# Altium schematic sheet 4-Power.SchDoc
size A
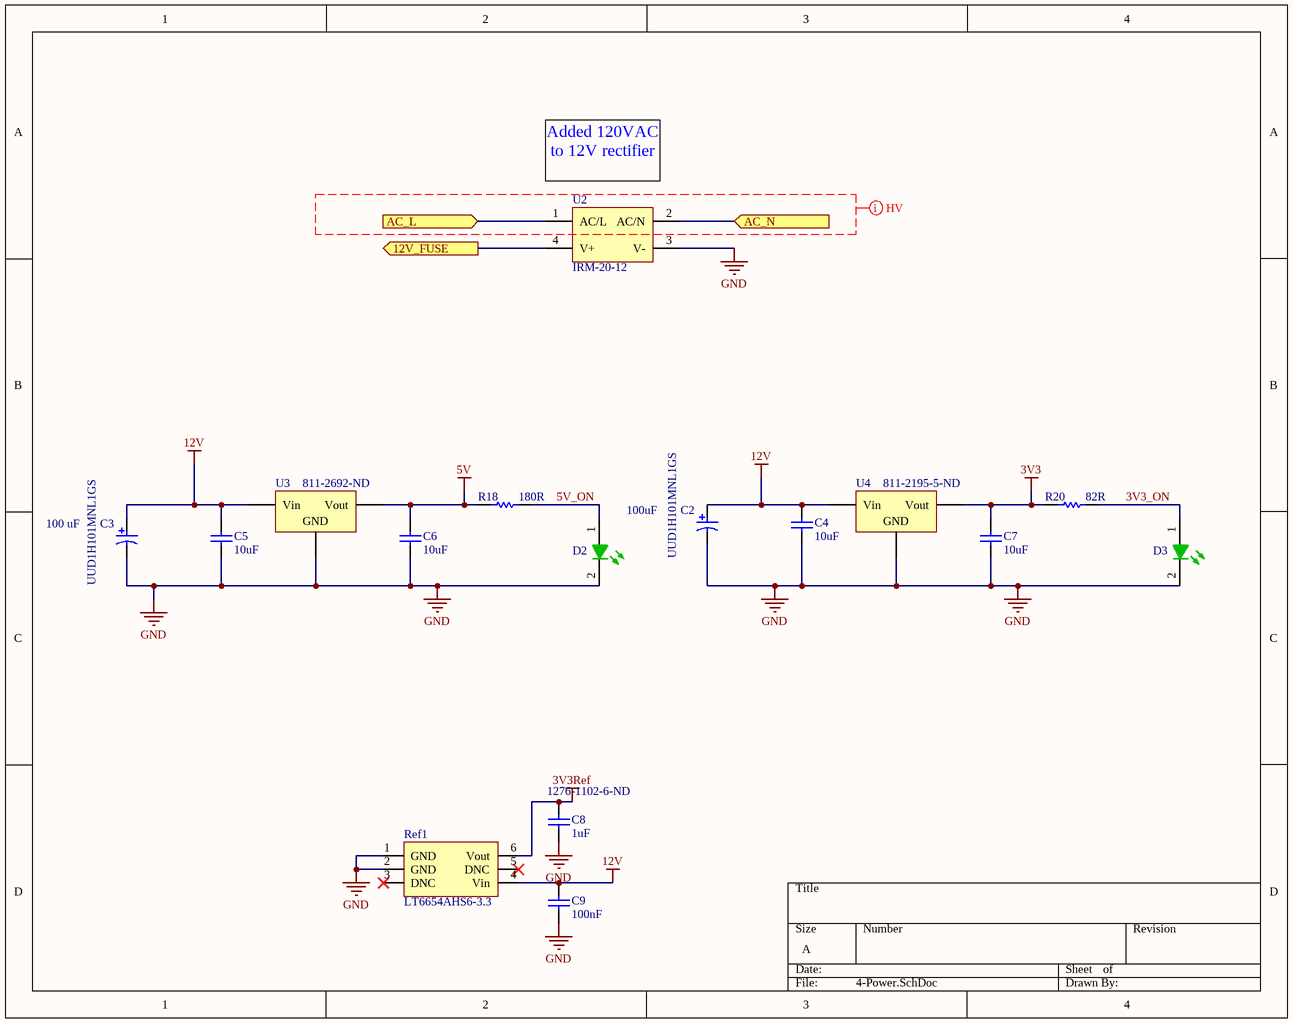
[diagram p0: 4-Power.SchDoc]

## Parts
C2  UUD1H101MNL1GS  [NIC-CAPA2-8X10_V]
C3  UUD1H101MNL1GS  Rated Capacitance: 100 uF  [NIC-CAPA2-8X10_V]
C4  value 10uF  [C1210_M]  (hidden comment: Cap)
C5  value 10uF  [C1210_M]  (hidden comment: Cap)
C6  value 10uF  [C1210_M]  (hidden comment: Cap)
C7  value 10uF  [C1210_M]  (hidden comment: Cap)
C8  value 1uF  Supplier Part Number 1: 1276-1102-6-ND  [1608[0603]]  (hidden comment: Cap)
C9  value 100nF  [1608[0603]]  (hidden comment: Cap)
D2  KP-1608MGC  [KING-0603LED_GREEN_V]  (value not drawn)
D3  KP-1608MGC  [KING-0603LED_GREEN_V]  (value not drawn)
R18  value 180R  [1608[0603]]  (hidden comment: Res1)
R20  value 82R  [1608[0603]]  (hidden comment: Res1)
Ref1  LT6654AHS6-3.3  [TSOT-23]
U2  IRM-20-12  [MEANW-IRM-20-12]
U3  Supplier Part Number 1: 811-2692-ND  [DCDC_HORIZONTAL]  (hidden comment: Volt Reg)
U4  Supplier Part Number 1: 811-2195-5-ND  [DCDC_VERTICAL]  (hidden comment: Volt Reg)

## Ports
12V_FUSE (out), AC_L (in), AC_N (in)

## Nets
3V3: C7.2 R20.1 U4.3(Vout)
3V3Ref: C8.2 Ref1.6(Vout)
5V: C6.2 R18.1 U3.3(Vout)
12V: C2.1 C3.1 C4.2 C5.2 C9.2 Ref1.4(Vin) U3.1(Vin) U4.1(Vin)
GND: C2.2 C3.2 C4.1 C5.1 C6.1 C7.1 C8.1 C9.1 D2.2(K) D3.2(K) Ref1.1(GND) Ref1.2(GND) U2.3(V-) U3.2(GND) U4.2(GND)
3V3_ON: D3.1(A) R20.2
5V_ON: D2.1(A) R18.2
12V_FUSE: U2.4(V+) ; port 12V_FUSE
AC_L: U2.1(AC/L) ; port AC_L
AC_N: U2.2(AC/N) ; port AC_N

Not connected (* = marked no-connect by the designer): Ref1 3(DNC)* 5(DNC)*

## Layout directives
mark named HV: (no net found under the mark)

## Notes on the sheet
- (near U2) Added 120VAC to 12V rectifier
- 100uF

## Library data of the parts
C2 = CMP-0687-00073-1: Aluminum Electrolytic Capacitor, UD Series, Low Impedance, 100 uF, 50 V, + / - 20%, -55 to 105 degC, Chip Type, 8 x 10 mm D x L, Pb-Free, Reel; Manufacturer: Nichicon; Rated Ripple Current (at 100kHz): 300 mA; Tolerance Rated Capacitance: -20 to 20%; Packing: Dia382mm Reel; Impedance: 0.34 Ohm; Rated Voltage: 50 V; Endurance Time: 5000 h; Rated Capacitance: 100 uF; Capacitance: 100µF; Voltage Rating: 50V; Lifetime @ Temp.: 5000 Hrs @ 105°C; Polarization: Polar; Ripple Current: 300mA; Surface Mount Land Size: 0.327" L x 0.327" W (8.30mm x 8.30mm); ComponentLink3Description: Package Specification; ComponentLink2Description: Datasheet; PackageReference: CAPAE-D8H10; RoHS: TRUE; Length: 10 mm; Mounting Technology: Surface Mount; PackageDescription: 2-Pin Surface Mount Device, Diameter 8 mm, Height 10 mm, Pitch 6.5 mm; DatasheetVersion: 08/2012; Diameter: 8 mm; ComponentLink3URL: http://products.nichicon.co.jp/en/pdf/XJA043/e-ud.pdf; ComponentLink1Description: Manufacturer URL; PartNumber: UUD1H101MNL1GS; ComponentLink2URL: http://products.nichicon.co.jp/en/pdf/XJA043/e-ud.pdf; ComponentLink1URL: http://www.nichicon.co.jp/; Supplier 1: Digi-Key; Supplier Part Number 1: 493-2306-1-ND; Manufacturer Part Number: UUD1H101MNL1GS; Category: Capacitors; Stock 1: 65948; Pricing 1: 1=0.92, 10=0.685, 25=0.5868, 50=0.5478, 100=0.4696, 250=0.43044 (CAD); Packaging: Cut Tape (CT); Part Status: Active; Tolerance: ±20%; ESR (Equivalent Series Resistance): -; Operating Temperature: -55°C ~ 105°C; Applications: General Purpose; Lead Spacing: -; Size / Dimension: 0.315" Dia (8.00mm); Height - Seated (Max): 0.394" (10.00mm); Mounting Type: Surface Mount; Package / Case: Radial, Can - SMD; ComponentLink4URL: http://nichicon-us.com/english/products/pdfs/e-uud.pdf; ComponentLink4Description: http://nichicon-us.com/english/products/pdfs/e-uud.pdf
C3 = CMP-0687-00073-1: Aluminum Electrolytic Capacitor, UD Series, Low Impedance, 100 uF, 50 V, + / - 20%, -55 to 105 degC, Chip Type, 8 x 10 mm D x L, Pb-Free, Reel; Manufacturer: Nichicon; Rated Ripple Current (at 100kHz): 300 mA; Tolerance Rated Capacitance: -20 to 20%; Packing: Dia382mm Reel; Impedance: 0.34 Ohm; Rated Voltage: 50 V; Endurance Time: 5000 h; Capacitance: 100µF; Voltage Rating: 50V; Lifetime @ Temp.: 5000 Hrs @ 105°C; Polarization: Polar; Ripple Current: 300mA; Surface Mount Land Size: 0.327" L x 0.327" W (8.30mm x 8.30mm); ComponentLink3Description: Package Specification; ComponentLink2Description: Datasheet; PackageReference: CAPAE-D8H10; RoHS: TRUE; Length: 10 mm; Mounting Technology: Surface Mount; PackageDescription: 2-Pin Surface Mount Device, Diameter 8 mm, Height 10 mm, Pitch 6.5 mm; DatasheetVersion: 08/2012; Diameter: 8 mm; ComponentLink3URL: http://products.nichicon.co.jp/en/pdf/XJA043/e-ud.pdf; ComponentLink1Description: Manufacturer URL; PartNumber: UUD1H101MNL1GS; ComponentLink2URL: http://products.nichicon.co.jp/en/pdf/XJA043/e-ud.pdf; ComponentLink1URL: http://www.nichicon.co.jp/; Supplier 1: Digi-Key; Supplier Part Number 1: 493-2306-1-ND; Manufacturer Part Number: UUD1H101MNL1GS; Category: Capacitors; Stock 1: 65948; Pricing 1: 1=0.92, 10=0.685, 25=0.5868, 50=0.5478, 100=0.4696, 250=0.43044 (CAD); Packaging: Cut Tape (CT); Part Status: Active; Tolerance: ±20%; ESR (Equivalent Series Resistance): -; Operating Temperature: -55°C ~ 105°C; Applications: General Purpose; Lead Spacing: -; Size / Dimension: 0.315" Dia (8.00mm); Height - Seated (Max): 0.394" (10.00mm); Mounting Type: Surface Mount; Package / Case: Radial, Can - SMD; ComponentLink4URL: http://nichicon-us.com/english/products/pdfs/e-uud.pdf; ComponentLink4Description: http://nichicon-us.com/english/products/pdfs/e-uud.pdf
C4-C7 = Cap: Capacitor; Manufacturer: Yageo; Manufacturer Part Number: CC1210ZKY5V8BB106; Capacitance: 10µF; Tolerance: -20%, +80%; Voltage - Rated: 25V; Temperature Coefficient: Y5V (F); Supplier 1: Digi-Key; Supplier Part Number 1: 311-2063-1-ND; RoHS: RoHS Compliant; Category: Capacitors; Stock 1: 1156; Pricing 1: 1=0.47, 10=0.323, 25=0.258, 50=0.2154, 100=0.1829, 250=0.14528, 500=0.12912, 1000=0.11298 (CAD); Packaging: Cut Tape (CT); Part Status: Active; Operating Temperature: -30°C ~ 85°C; Features: -; Ratings: -; Applications: General Purpose; Failure Rate: -; Mounting Type: Surface Mount, MLCC; Package / Case: 1210 (3225 Metric); Size / Dimension: 0.126" L x 0.098" W (3.20mm x 2.50mm); Height - Seated (Max): -; Thickness (Max): 0.083" (2.10mm); Lead Spacing: -; Lead Style: -; ComponentLink1URL: http://www.yageo.com/documents/recent/UPY-GPHC_Y5V_6.3V-to-50V_7.pdf; ComponentLink1Description: http://www.yageo.com/documents/recent/UPY-GPHC_Y5V_6.3V-to-50V_7.pdf
C8 = Cap: Capacitor; Manufacturer: Murata Electronics North America; Manufacturer Part Number: GRM188R61E105KA12D; Capacitance: 1µF; Tolerance: ±10%; Voltage - Rated: 25V; Temperature Coefficient: X5R; RoHS: RoHS Compliant; Category: Capacitors; Packaging: Cut Tape (CT); Part Status: Active; Operating Temperature: -55°C ~ 85°C; Features: -; Ratings: -; Applications: General Purpose; Mounting Type: Surface Mount, MLCC; Package / Case: 0603 (1608 Metric); Size / Dimension: 0.063" L x 0.031" W (1.60mm x 0.80mm); Height - Seated (Max): -; Thickness (Max): 0.035" (0.90mm); Lead Spacing: -; Lead Style: -; ComponentLink1URL: http://www.murata.com/~/media/webrenewal/support/library/catalog/products/capacitor/mlcc/c02e.pdf; ComponentLink1Description: http://www.murata.com/~/media/webrenewal/support/library/catalog/products/capacitor/mlcc/c02e.pdf; Supplier 1: Digi-Key
C9 = Cap: Capacitor; Manufacturer: Yageo; Manufacturer Part Number: CC0603KRX7R9BB104; Capacitance: 0.10µF; Tolerance: ±10%; Voltage - Rated: 50V; Temperature Coefficient: X7R; Supplier 1: Digi-Key; Supplier Part Number 1: 311-1344-1-ND; RoHS: RoHS Compliant; Category: Capacitors; Stock 1: 4016262; Pricing 1: 1=0.15, 10=0.043, 25=0.0312, 50=0.0232, 100=0.0189, 250=0.0158, 500=0.01346, 1000=0.01059 (CAD); Packaging: Cut Tape (CT); Part Status: Active; Operating Temperature: -55°C ~ 125°C; Features: -; Ratings: -; Applications: General Purpose; Failure Rate: -; Mounting Type: Surface Mount, MLCC; Package / Case: 0603 (1608 Metric); Size / Dimension: 0.063" L x 0.031" W (1.60mm x 0.80mm); Height - Seated (Max): -; Thickness (Max): 0.035" (0.90mm); Lead Spacing: -; Lead Style: -; ComponentLink1URL: http://www.yageo.com/documents/recent/UPY-GPHC_X7R_6.3V-to-50V_16.pdf; ComponentLink1Description: http://www.yageo.com/documents/recent/UPY-GPHC_X7R_6.3V-to-50V_16.pdf
D2 D3 = CMP-0404-00001-1: LED, SMT, 0603(1608), 1.1mm thickness, Green; Manufacturer: Kingbright; Reverse Voltage: 5 V; Power Dissipation: 75 mW; Forward Current: 30 mA; Packing Type: 2000 pcs / reel; Mounting Technology: Surface Mount; Storage Temperature: -40 to +85 degC; ComponentLink1URL: http://www.kingbright.com/; PackageDescription: 2-Pin SMT LED, 1.6 x 0.8 mm Pitch; PartNumber: KP-1608MGC; PackageReference: 0603LED_GREEN; ComponentLink1Description: Manufacturer URL; Supplier 1: Digi-Key; Supplier Part Number 1: 732-4980-1-ND
R18 = Res1: Resistor; Manufacturer: Yageo; Manufacturer Part Number: RC0603JR-07180RL; Resistance (Ohms): 180; Tolerance: ±5%; Power (Watts): 0.1W, 1/10W; Temperature Coefficient: ±100ppm/°C; Supplier 1: Digi-Key; Supplier Part Number 1: 311-180GRCT-ND; RoHS: RoHS Compliant; Category: Resistors; Stock 1: 201936; Pricing 1: 1=0.16, 10=0.016, 25=0.0112, 50=0.0084, 100=0.0062, 250=0.0048, 500=0.00382, 1000=0.00281 (CAD); Packaging: Cut Tape (CT); Part Status: Active; Composition: Thick Film; Features: Moisture Resistant; Operating Temperature: -55°C ~ 155°C; Package / Case: 0603 (1608 Metric); Supplier Device Package: 0603; Size / Dimension: 0.063" L x 0.031" W (1.60mm x 0.80mm); Height - Seated (Max): 0.022" (0.55mm); Number of Terminations: 2; Failure Rate: -; ComponentLink1URL: http://www.yageo.com/NewPortal/yageodocoutput?fileName=/pdf/R-Chip/PYu-RC_Group_51_RoHS_L_4.pdf; ComponentLink1Description: http://www.yageo.com/NewPortal/yageodocoutput?fileName=/pdf/R-Chip/PYu-RC_Group_51_RoHS_L_4.pdf
R20 = Res1: Resistor; Manufacturer: Yageo; Manufacturer Part Number: RC0603JR-0782RL; Resistance (Ohms): 82; Tolerance: ±5%; Power (Watts): 0.1W, 1/10W; Temperature Coefficient: ±100ppm/°C; Supplier 1: Digi-Key; Supplier Part Number 1: 311-82GRCT-ND; RoHS: RoHS Compliant; Category: Resistors; Stock 1: 72049; Pricing 1: 1=0.16, 10=0.016, 25=0.0112, 50=0.0084, 100=0.0062, 250=0.0048, 500=0.00382, 1000=0.00281 (CAD); Packaging: Cut Tape (CT); Part Status: Active; Composition: Thick Film; Features: Moisture Resistant; Operating Temperature: -55°C ~ 155°C; Package / Case: 0603 (1608 Metric); Supplier Device Package: 0603; Size / Dimension: 0.063" L x 0.031" W (1.60mm x 0.80mm); Height - Seated (Max): 0.022" (0.55mm); Number of Terminations: 2; Failure Rate: -; ComponentLink1URL: http://www.yageo.com/NewPortal/yageodocoutput?fileName=/pdf/R-Chip/PYu-RC_Group_51_RoHS_L_4.pdf; ComponentLink1Description: http://www.yageo.com/NewPortal/yageodocoutput?fileName=/pdf/R-Chip/PYu-RC_Group_51_RoHS_L_4.pdf
Ref1 = LT6654AHS6-3.3: TSOT-23-56; Manufacturer: Linear Technology; Reference Type: Series; Output Type: Fixed; Voltage - Output (Min/Fixed): 3.3V; Current - Output: 10mA; Tolerance: ±0.05%; Temperature Coefficient: 10ppm/°C; Noise - 0.1Hz to 10Hz: 1.7ppmp-p; Noise - 10Hz to 10kHz: 2ppmrms; Voltage - Input: 3.8 V ~ 36 V; Current - Supply: 600µA; Manufacturer Part Number: LT6654AHS6-3.3; Digikey Part Number: LT6654AHS6-3.3#TRMPBFCT-ND; Digikey Link: http://www.digikey.com/product-detail/en/linear-technology/LT6654AHS6-3.3-TRMPBF/LT6654AHS6-3.3-TRMPBFCT-ND/2485839; Supplier 1: Digi-Key; Supplier Part Number 1: LT6654AHS6-3.3#TRMPBFCT-ND; RoHS: RoHS Compliant; Category: Integrated Circuits (ICs); Stock 1: 1315; Pricing 1: 1=9.53, 25=8.508, 100=5.5596, 250=5.1048 (CAD); Packaging: Cut Tape (CT); Part Status: Active; Voltage - Output (Max): -; Current - Cathode: -; Operating Temperature: -40°C ~ 125°C (TA); Mounting Type: Surface Mount; Package / Case: SOT-23-6 Thin, TSOT-23-6; Supplier Device Package: TSOT-23-6; ComponentLink1URL: http://www.linear.com/docs/29677; ComponentLink1Description: http://www.linear.com/docs/29677
U2 = CMP-2000-07460-1: Single Output Encapsulated Type, 12 V, 1.8 A, 21.6 W, -40 to 85 degC, 4-Pin THD, RoHS; Manufacturer: Mean Well; Output Current: 1.8A; Output Power: 21.6W; Voltage - Output 1: 12V; Efficiency: 84%; Approvals: CB; Number of Outputs: 1; Length: 53mm; RoHSCompliant: true; Lead Free: LeadFree; Packaging: Bulk; Package Description: 4-Pin Through Hole Device, Body 52.4 x 27.2 mm, Height 24 mm; Number of Pins: 4; Mount: ThroughHole; Min Operating Temperature: -30degC; Manufacturer URL: http://www.meanwellusa.com/; Weight: 2.081164oz; Package Quantity: 240; Package Reference: IRM-20-12-4; Datasheet URL: http://datasheet.octopart.com/IRM-20-12-Mean-Well-datasheet-42021592.pdf; Max Output Power: 21.6W; Max Operating Temperature: 70degC; Height: 24mm; Mounting Technology: ThroughHole; Datasheet Version: 06/2015; Current - Output 1: 1.8A; Width: 28mm; Supplier 1: Digi-Key; Supplier Part Number 1: 1866-3038-ND
U3 U4 = Volt Reg: Voltage Regulator; Published: 24-Mar-1999; LatestRevisionDate: 29-May-2009; LatestRevisionNote: IPC-7351 Footprint Added.; PackageReference: D2PAK; Publisher: Altium Limited; PackageDescription: 3-Pin Transistor Outline Package 2.54 mm Pitch, 15.1 mm Lead Span; Supplier 1: Digi-Key